# EAGLE design SerialGateway (EAGLE 7.3.0)
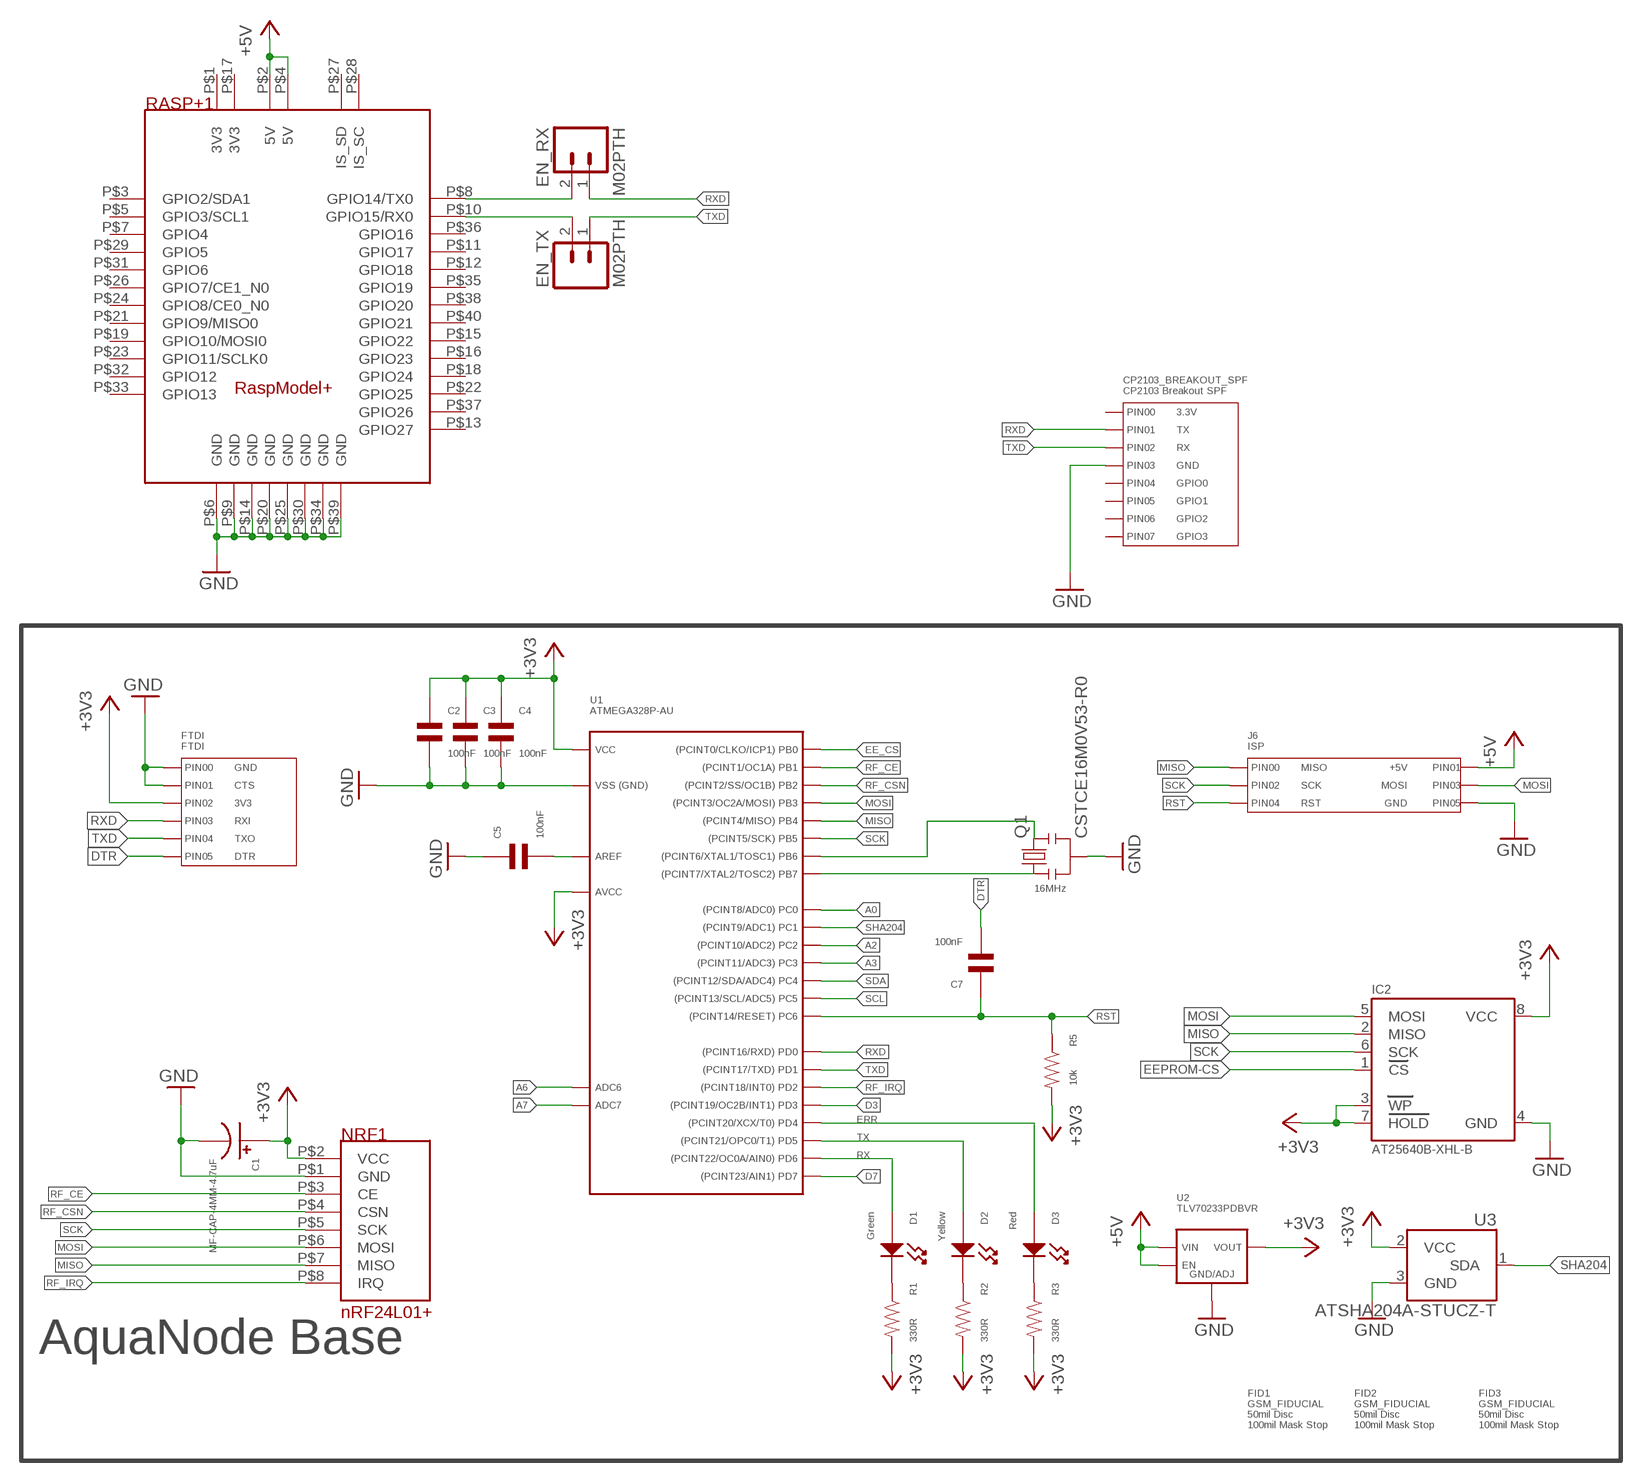
[diagram p0: schematic, sheet 1]

## Parts
C1  MF-CAP-4MM-4.7uF  CAPACITOR_P_4MM  [CP4MM]
C2  100nF  CAPACITOR_NP_0603  [C0603]
C3  100nF  CAPACITOR_NP_0603  [C0603]
C4  100nF  CAPACITOR_NP_0603  [C0603]
C5  100nF  CAPACITOR_NP_0603  [C0603]
C7  100nF  CAPACITOR_NP_0603  [C0603]
CP2103_BREAKOUT_SPF  CP2103 Breakout SPF  HEADER_01X08_PTH_2.54MM  [PTH_2.54MM_01X08]
D1  Green  LED_SINGLE_0805  [LED0805]
D2  Yellow  LED_SINGLE_0805  [LED0805]
D3  Red  LED_SINGLE_0805  [LED0805]
EN_RX  M02PTH  [1X02]
EN_TX  M02PTH  [1X02]
FID1  GSM_FIDUCIAL  [GSM_FIDUCIAL]
FID2  GSM_FIDUCIAL  [GSM_FIDUCIAL]
FID3  GSM_FIDUCIAL  [GSM_FIDUCIAL]
FTDI  FTDI  HEADER_01X06_PTH_2.54MM  [PTH_2.54MM_01X06]
IC2  AT25640B-XHL-B  EEPROM_SPI_AT25040ATSSOP  [TSSOP8-4.4MM]
J6  ISP  HEADER_02X03_PTH_2.54MM  [PTH_2.54MM_02X03]
NRF1  4Fx2-254mm  NRF24L01+.EBAY  [NRF24L01+.EBAY]
Q1  CSTCE16M0V53-R0  RESONATORSMD  [RESONATOR-SMD]
R1  330R  RESISTOR_0603  [R0603]
R2  330R  RESISTOR_0603  [R0603]
R3  330R  RESISTOR_0603  [R0603]
R5  10k  RESISTOR_0603  [R0603]
RASP+1  RASPBERRY_PI_PLUSHAT  [RASPBARRY_PI_PLUS_HAT]
U1  ATMEGA328P-AU  [TQFP32]
U2  TLV70233PDBVR  [SOT-23-5]
U3  ATSHA204A-STUCZ-T  ATSHA204-TSU  [SOT23-3]

## Nets
+3V3 [power1]: C1.P$1 C2.P$1 C3.P$1 C4.P$1 FTDI.P$3(PIN2) IC2.3(WP) IC2.7(HOLD) IC2.8(VCC) NRF1.P$2(VCC) R1.P$2 R2.P$2 R3.P$2 R5.P$2 U1.P$4(VCC) U1.P$6(VCC) U1.P$18(AVCC) U2.P$5(VOUT) U3.2(VCC)
+5V [power1]: J6.P$2(PIN1) RASP+1.P$2(5V) RASP+1.P$4(5V) U2.P$1(VIN) U2.P$3(EN)
A0: U1.P$23(PC0)
A2: U1.P$25(PC2)
A3: U1.P$26(PC3)
A6: U1.P$19(ADC6)
A7: U1.P$22(ADC7)
D3: U1.P$1(PD3)
D7: U1.P$11(PD7)
DTR: C7.P$2 FTDI.P$6(PIN5)
EE_CS: U1.P$12(PB0)
EEPROM-CS: IC2.1(CS)
ERR: D3.ANODE U1.P$2(PD4)
GND [power1]: C1.P$2 C2.P$2 C3.P$2 C4.P$2 C5.P$1 CP2103_BREAKOUT_SPF.P$4(PIN3) FTDI.P$1(PIN0) FTDI.P$2(PIN1) IC2.4(GND) J6.P$6(PIN5) NRF1.P$1(GND) Q1.2 RASP+1.P$6(GND) RASP+1.P$9(GND) RASP+1.P$14(GND) RASP+1.P$20(GND) RASP+1.P$25(GND) RASP+1.P$30(GND) RASP+1.P$34(GND) RASP+1.P$39(GND) U1.P$3(GND) U1.P$5(GND) U1.P$21(GND) U2.P$2(GND/ADJ) U3.3(GND)
MISO: IC2.2(MISO) J6.P$1(PIN0) NRF1.P$7(MISO) U1.P$16(PB4)
MOSI: IC2.5(MOSI) J6.P$4(PIN3) NRF1.P$6(MOSI) U1.P$15(PB3)
N$1: EN_RX.2 RASP+1.P$8(GPIO14/TX0)
N$2: EN_TX.2 RASP+1.P$10(GPIO15/RX0)
N$3: D1.CATHODE R1.P$1
N$4: C5.P$2 U1.P$20(AREF)
N$5: D2.CATHODE R2.P$1
N$6: D3.CATHODE R3.P$1
N$22: Q1.3 U1.P$7(PB6)
N$23: Q1.1 U1.P$8(PB7)
RF_CE: NRF1.P$3(CE) U1.P$13(PB1)
RF_CSN: NRF1.P$4(CSN) U1.P$14(PB2)
RF_IRQ: NRF1.P$8(IRQ) U1.P$32(PD2)
RST: C7.P$1 J6.P$5(PIN4) R5.P$1 U1.P$29(PC6)
RX: D1.ANODE U1.P$10(PD6)
RXD: CP2103_BREAKOUT_SPF.P$2(PIN1) EN_RX.1 FTDI.P$4(PIN3) U1.P$30(PD0)
SCK: IC2.6(SCK) J6.P$3(PIN2) NRF1.P$5(SCK) U1.P$17(PB5)
SCL: U1.P$28(PC5)
SDA: U1.P$27(PC4)
SHA204: U1.P$24(PC1) U3.1(SDA)
TX: D2.ANODE U1.P$9(PD5)
TXD: CP2103_BREAKOUT_SPF.P$3(PIN2) EN_TX.1 FTDI.P$5(PIN4) U1.P$31(PD1)
Unconnected: CP2103_BREAKOUT_SPF.P$1(PIN0) CP2103_BREAKOUT_SPF.P$5(PIN4) CP2103_BREAKOUT_SPF.P$6(PIN5) CP2103_BREAKOUT_SPF.P$7(PIN6) CP2103_BREAKOUT_SPF.P$8(PIN7) RASP+1.P$3(GPIO2/SDA1) RASP+1.P$5(GPIO3/SCL1) RASP+1.P$7(GPIO4) RASP+1.P$11(GPIO17) RASP+1.P$12(GPIO18) RASP+1.P$13(GPIO27) RASP+1.P$15(GPIO22) RASP+1.P$16(GPIO23) RASP+1.P$18(GPIO24) RASP+1.P$19(GPIO10/MOSI0) RASP+1.P$21(GPIO9/MISO0) RASP+1.P$22(GPIO25) RASP+1.P$23(GPIO11/SCLK0) RASP+1.P$24(GPIO8/CE0_N0) RASP+1.P$26(GPIO7/CE1_N0) RASP+1.P$27(IS_SD) RASP+1.P$28(IS_SC) RASP+1.P$29(GPIO5) RASP+1.P$31(GPIO6) RASP+1.P$32(GPIO12) RASP+1.P$33(GPIO13) RASP+1.P$35(GPIO19) RASP+1.P$36(GPIO16) RASP+1.P$37(GPIO26) RASP+1.P$38(GPIO20) RASP+1.P$40(GPIO21)

## Notes on the sheet
- 16MHz
- AquaNode Base

## Power pins joined to a net without a drawn wire
3V3: RASP+1.P$1(3V3) RASP+1.P$17(3V3)

## Library data of the parts
C1 = MF_Passives:CAPACITOR_P: Library: MF_Passives Description: Device for Polarized Capacitors. Manufacture part number (MFG#), Voltage Rating, and Tolerance can be added via Attributes.; MFG#: N/A; TOLERANCE: N/A; VOLTAGE: N/A
C2-C5 C7 = MF_Passives:CAPACITOR_NP: Library: MF_Passives Description: Device for Non-Polarized Capacitors. Manufacture part number (MFG#), Voltage, Temperature Coefficient, and Tolerance can be added via Attributes.; MFG#: N/A; TEMP_COF: N/A; TOLERANCE: N/A; VOLTAGE: N/A
CP2103_BREAKOUT_SPF = MF_Connectors:HEADER_01X08: Library: MF_Connectors Description: Header Connector with 8 Positions and 01 Rows. Use the LABEL Attribute to label the pin on the schematic and PCB. You can remove the attributes on the PCB by using the SMASH function on the part and then deleting the text.; LABEL00: 3.3V; LABEL01: TX; LABEL02: RX; LABEL03: GND; LABEL04: GPIO0; LABEL05: GPIO1; LABEL06: GPIO2; LABEL07: GPIO3
D1-D3 = MF_LEDs:LED_SINGLE: Library: MF_LEDs Description: Device for Single LED Packages. Manufacture part number (MFG#) can be added via Attributes.
EN_RX EN_TX = SparkFun-Connectors:M02: Standard 2-pin 0.1" header. Use with - straight break away headers ( PRT-00116) - right angle break away headers (PRT-00553) - swiss pins (PRT-00743) - machine pins (PRT-00117) - female headers (PRT-00115) Molex polarized connector foot print use with: PRT-08233 with associated crimp pins and housings. 2.54_SCREWTERM for use with PRT-10571. 3.5mm Screw Terminal footprints for PRT-08084 5mm Screw Terminal footprints for use with PRT-08433
FID1-FID3 = MF_Aesthetics:GSM_FIDUCIAL: Library: MF_Aesthetics Description: Fiducial marking for PCB alignment inside PNP and other machines.
FTDI = MF_Connectors:HEADER_01X06: Library: MF_Connectors Description: Header Connector with 6 Positions and 01 Rows. Use the LABEL Attribute to label the pin on the schematic and PCB. You can remove the attributes on the PCB by using the SMASH function on the part and then deleting the text.; LABEL00: GND; LABEL01: CTS; LABEL02: 3V3; LABEL03: RXI; LABEL04: TXO; LABEL05: DTR
IC2 = microbuilder:EEPROM_SPI_AT25040A: AT25010a/40a EEPROM SOIC8 AT25010a, 1K (128 x 8 bit) - Digikey: AT25010AN-10SU2.7-ND AT25040a, 4K (256 x 8 bit) - Digikey: AT25040AN-10SU1.8-ND TSSOP8 AT25010a, 1K (128 x 8 bit) - Digikey: AT25010A-10TU-1.8-ND AT25040a, 4K (256 x 8 bit) - Digikey: AT25040A-10TU-1.8-ND
J6 = MF_Connectors:HEADER_02X03: Library: MF_Connectors Description: Header Connector with 6 Positions and 02 Rows. Use the LABEL Attribute to label the pin on the schematic and PCB. You can remove the attributes on the PCB by using the SMASH function on the part and then deleting the text.; LABEL00: MISO; LABEL01: +5V; LABEL02: SCK; LABEL03: MOSI; LABEL04: RST; LABEL05: GND
NRF1 = TDK:NRF24L01+.EBAY
Q1 = _allyourbase:RESONATOR: Resonator Small SMD resonator. This is the itty bitty 10/20MHz resonators with built in caps. CSTCE10M0G55 and CSTCE20M0V53. Footprint has been reviewed closely but hasn't been tested yet.
R1-R3 R5 = MF_Passives:RESISTOR: Library: MF_Passives Description: Device for Resistors. Manufacture part number (MFG#), Voltage, Tolerance, and Wattage Rating can be added via Attributes.; MFG#: N/A; TOLERANCE: N/A; VOLTAGE: N/A; WATTAGE: N/A
RASP+1 = TDK:RASPBERRY_PI_PLUS
U1 = MF_IC_Digital:ATMEGA328P: Manufacturer Part #: ATMEGA328P Manufacturer: Atmel Description: 8-bit Microcontrollers - MCU 32KB In-system Flash 20MHz 1.8V-5.5V
U2 = MF_IC_Power:TLV702: Manufacturer Part #: TLV702 Manufacturer: Texas Instruments Description: LDO Voltage Regulators
U3 = SparkFun-DigitalIC:ATSHA204: Atmel ATSHA204 The Atmel ATSHA204 is an optimized authentication chip that includes a 4.5Kb EEPROM. This array can be used for storage of keys, miscellaneous read/write, read-only, password or secret data, and consumption tracking. Access to the various sections of memory can be restricted in a variety of ways and then the configuration locked to prevent changes.

## Board
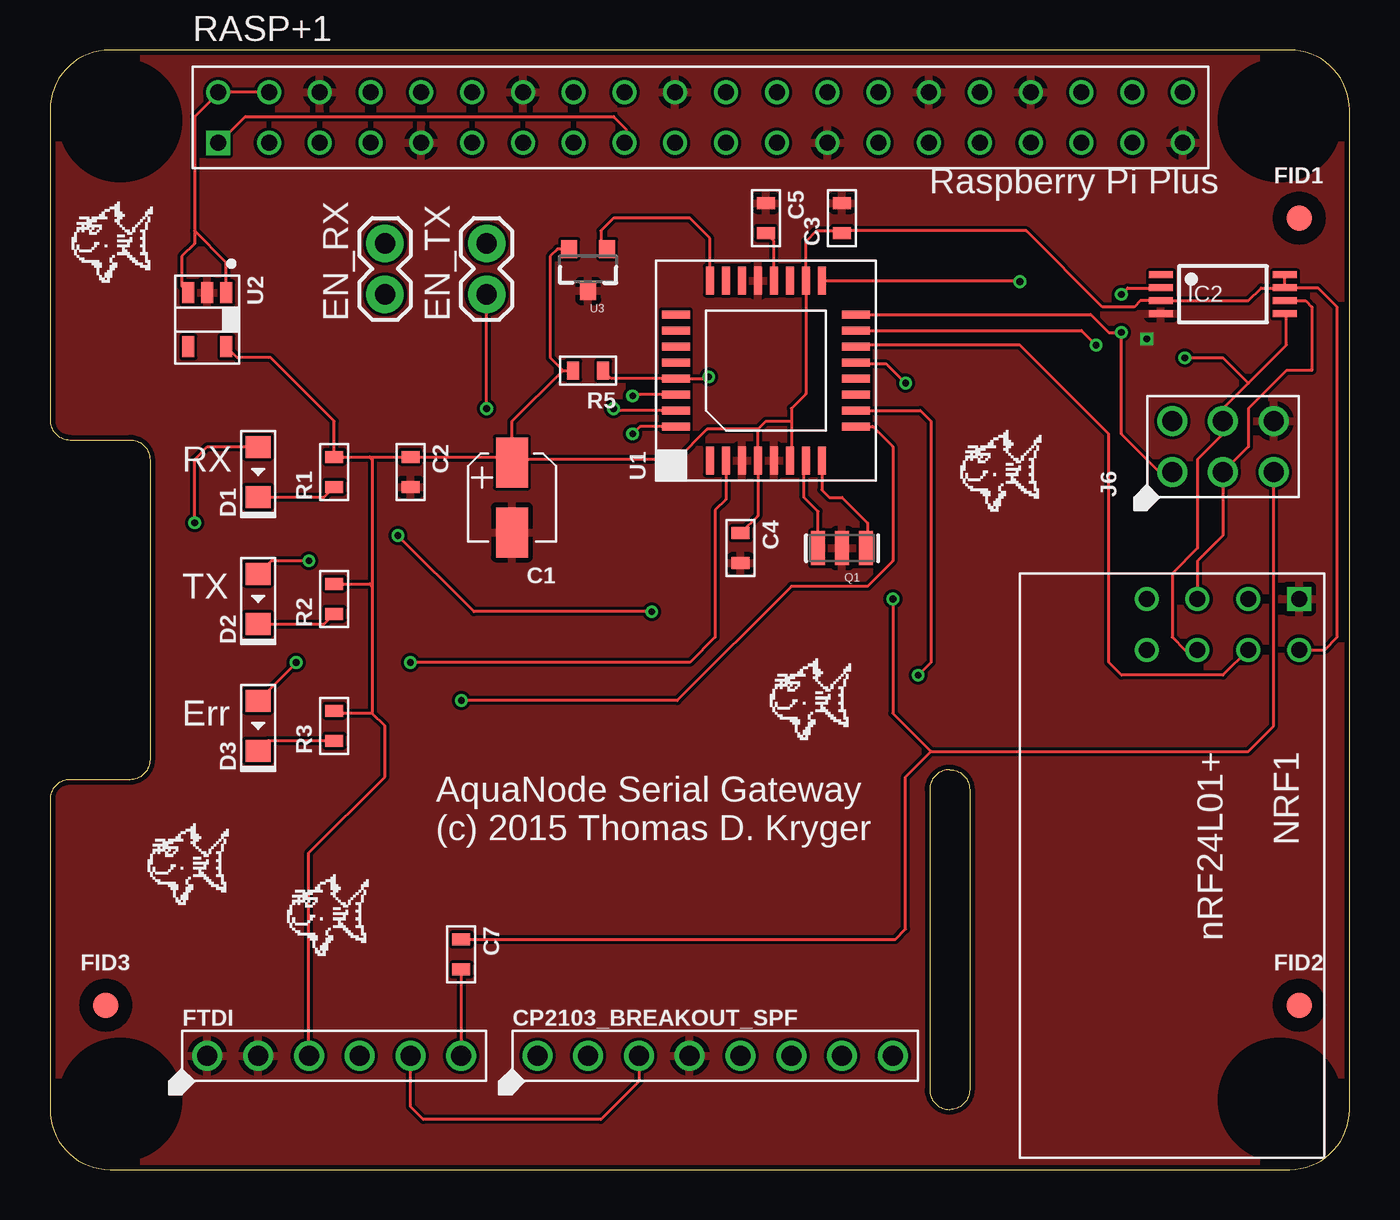
[diagram p1: board, top side]
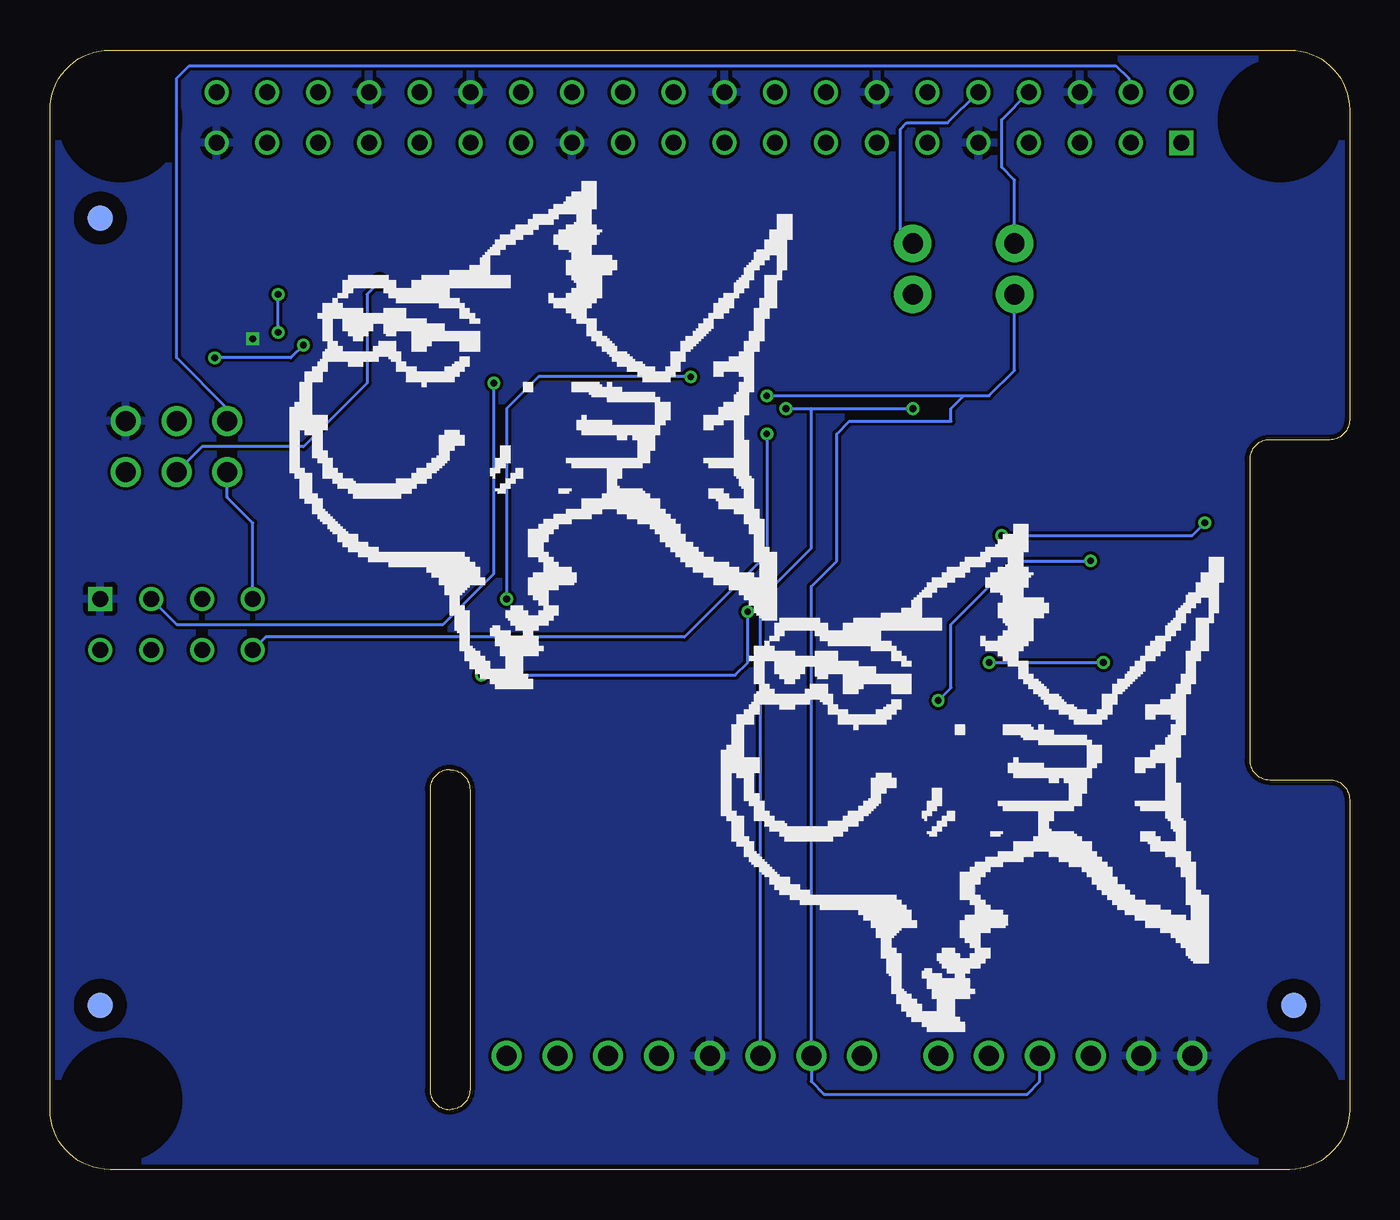
[diagram p2: board, bottom side, seen from below]

Size 65 x 56 mm. Coordinates in mm from the lower left corner, seen from the top.
Copper layers (1*16): Top 0.035mm / dielectric 0.2mm / Bottom 0.035mm
Design rules "MacroFab_MF_2_Layer": minimum track width 6mil, minimum drill 12mil, track to track 6mil, track to pad 6mil, pad to pad 6mil, via to via 6mil, smd to smd 0mil, copper to edge 10mil, drill to drill 10mil, minimum pad ring 6mil, minimum via ring 6mil, stop-mask expansion 2mil, vias tented up to drill 25mil, thermal gap 10mil

### Footprints (pad centres in the part's own frame; a part is rotated, then mirrored left to right if it is on the bottom)
CP4MM = smd 1.6 x 2.5: P$1 0,-1.75; P$2 0,1.75
C0603 = smd 0.6 x 0.9: P$1 -0.75,0; P$2 0.75,0
PTH_2.54MM_01X08 = drill 1: P$1 -8.89,0; P$2 -6.35,0; P$3 -3.81,0; P$4 -1.27,0; P$5 1.27,0; P$6 3.81,0; P$7 6.35,0; P$8 8.89,0
LED0805 = smd 1.1 x 1.25: ANODE 1.25,0; CATHODE -1.25,0
1X02 = drill 1.016 pad 1.88: 1 0,0; 2 2.54,0
GSM_FIDUCIAL = smd 1.27 x 1.27: P$1 0,0 | smd 1.27 x 1.27 bottom: P$2 0,0
PTH_2.54MM_01X06 = drill 1: P$1 -6.35,0; P$2 -3.81,0; P$3 -1.27,0; P$4 1.27,0; P$5 3.81,0; P$6 6.35,0
TSSOP8-4.4MM = smd 1.2 x 0.35: 1 -3.1,0.975; 2 -3.1,0.325; 3 -3.1,-0.325; 4 -3.1,-0.975; 5 3.1,-0.975; 6 3.1,-0.325; 7 3.1,0.325; 8 3.1,0.975
PTH_2.54MM_02X03 = drill 1: P$1 -2.54,-1.27; P$2 -2.54,1.27; P$3 0,-1.27; P$4 0,1.27; P$5 2.54,-1.27; P$6 2.54,1.27
NRF24L01+.EBAY = drill 0.8 square: P$1 -1.27,5.08 | drill 0.8: P$2 1.27,5.08; P$3 -1.27,2.54; P$4 1.27,2.54; P$5 -1.27,0; P$6 1.27,0; P$7 -1.27,-2.54; P$8 1.27,-2.54
RESONATOR-SMD = smd 0.7 x 1.7: 1 -1.2,0; 2 0,0; 3 1.2,0
R0603 = smd 0.6 x 0.9: P$1 -0.75,0; P$2 0.75,0
RASPBARRY_PI_PLUS_HAT = drill 0.8 square: P$1 -23.59,25.35 | drill 0.8: P$2 -23.59,27.89; P$3 -21.05,25.35; P$4 -21.05,27.89; P$5 -18.51,25.35; P$6 -18.51,27.89; P$7 -15.97,25.35; P$8 -15.97,27.89; P$9 -13.43,25.35; P$10 -13.43,27.89; P$11 -10.89,25.35; P$12 -10.89,27.89; P$13 -8.35,25.35; P$14 -8.35,27.89; P$15 -5.81,25.35; P$16 -5.81,27.89; P$17 -3.27,25.35; P$18 -3.27,27.89; P$19 -0.73,25.35; P$20 -0.73,27.89; P$21 1.81,25.35; P$22 1.81,27.89; P$23 4.35,25.35; P$24 4.35,27.89; P$25 6.89,25.35; P$26 6.89,27.89; P$27 9.43,25.35; P$28 9.43,27.89; P$29 11.97,25.35; P$30 11.97,27.89; P$31 14.51,25.35; P$32 14.51,27.89; P$33 17.05,25.35; P$34 17.05,27.89; P$35 19.59,25.35; P$36 19.59,27.89; P$37 22.13,25.35; P$38 22.13,27.89; P$39 24.67,25.35; P$40 24.67,27.89
TQFP32 = smd 1.4 x 0.4: P$1 -4.5,2.8; P$2 -4.5,2; P$3 -4.5,1.2; P$4 -4.5,0.4; P$5 -4.5,-0.4; P$6 -4.5,-1.2; P$7 -4.5,-2; P$8 -4.5,-2.8; P$17 4.5,-2.8; P$18 4.5,-2; P$19 4.5,-1.2; P$20 4.5,-0.4; P$21 4.5,0.4; P$22 4.5,1.2; P$23 4.5,2; P$24 4.5,2.8 | smd 0.4 x 1.4: P$9 -2.8,-4.5; P$10 -2,-4.5; P$11 -1.2,-4.5; P$12 -0.4,-4.5; P$13 0.4,-4.5; P$14 1.2,-4.5; P$15 2,-4.5; P$16 2.8,-4.5; P$25 2.8,4.5; P$26 2,4.5; P$27 1.2,4.5; P$28 0.4,4.5; P$29 -0.4,4.5; P$30 -1.2,4.5; P$31 -2,4.5; P$32 -2.8,4.5
SOT-23-5 = smd 1.05 x 0.6: P$1 -1.35,0.95; P$2 -1.35,0; P$3 -1.35,-0.95; P$4 1.35,-0.95; P$5 1.35,0.95
SOT23-3 = smd 0.8 x 0.9: 1 -0.95,-1; 2 0.95,-1; 3 0,1.1

### Placement (x,y rotation side)
C1  23.11,33.62 180 top
C2  18.03,34.89 270 top
C3  39.62,47.59 90 top
C4  34.54,31.08 270 top
C5  35.81,47.59 270 top
C7  20.57,10.76 270 top
CP2103_BREAKOUT_SPF  33.27,5.68 0 top
D1  10.41,34.89 90 top
D2  10.41,28.54 90 top
D3  10.41,22.19 90 top
EN_RX  16.76,43.78 90 top
EN_TX  21.84,43.78 90 top
FID1  62.48,47.59 0 top
FID2  62.48,8.22 0 top
FID3  2.79,8.22 0 top
FTDI  14.22,5.68 0 top
IC2  58.67,43.78 0 top
J6  58.67,36.16 0 top
NRF1  57.4,27.27 270 top
Q1  39.62,31.08 180 top
R1  14.22,34.89 90 top
R2  14.22,28.54 90 top
R3  14.22,22.19 90 top
R5  26.92,39.97 180 top
RASP+1  32,26 0 top
U1  35.81,39.97 90 top
U2  7.87,42.51 270 top
U3  26.92,45.05 180 top
U$1  [THEFISH_SMALL]  6.6,15.2 0 top
U$2  [THEFISH_SMALL]  13.58,12.66 0 top
U$3  [THEFISH_SMALL]  37.71,23.46 0 top
U$4  [THEFISH_SMALL]  2.79,46.32 0 top
U$5  [THEFISH_SMALL]  47.24,34.89 0 top
U$6  [THEFISH]  31.36,6.95 0 bottom
U$7  [THEFISH]  52.95,24.09 0 bottom

### Tracks (layer width: path | path; a pad name or v marks a point on that pad's centre or on a via)
3V3
  Top 0.152: RASP+1.P$1 8.45,51.35 9.77,52.67 28.19,52.67 28.82,52.03 28.82,51.45 RASP+1.P$17
+3V3
  Top 0.152: FTDI.P$3 12.95,15.84 16.76,19.65 16.76,22.19 16.12,22.82 | 16.12,22.82 14.33,22.82 R3.P$2 | R1.P$2 C2.P$1 22.84,35.64 C1.P$1 | R1.P$2 14.22,37.43 11.04,40.6 9.37,40.6 U2.P$5 | R1.P$2 16.01,35.64 16.12,35.52 16.12,29.17 | 16.12,29.17 16.12,22.82 | R2.P$2 16.01,29.29 16.12,29.17 | 37.08,37.43 37.08,38.06 37.81,38.8 U1.P$18 37.81,46.41 38.35,46.95 39.5,46.95 C3.P$1 39.73,46.95 48.83,46.95 52.64,43.15 54.22,43.15 54.53,43.45 IC2.3 59.93,43.45 60.58,44.1 61.76,44.1 IC2.7 | 37.08,37.43 37.08,35.54 U1.P$6 | 35.41,37.03 U1.P$4 35.41,32.7 C4.P$1 | 35.41,37.03 35.81,37.43 37.08,37.43 | C1.P$1 23.11,37.43 25.65,39.97 | 25.65,39.97 R5.P$2 | U3.2 25.38,46.05 25.02,45.69 25.02,40.6 25.65,39.97 | IC2.7 IC2.8 | NRF1.P$2 63.75,26 64.38,26.63 64.38,43.15 63.43,44.1 61.78,44.1 IC2.7 | 35.41,37.03 32.87,37.03 31.36,35.52 23.27,35.52 C1.P$1
+5V
  Top 0.152: RASP+1.P$4 RASP+1.P$2 8.41,53.84 7.23,52.67 7.23,46.95 | 7.23,46.95 7.23,46.32 6.6,45.69 6.6,44.18 U2.P$3 | U2.P$1 8.82,45.37 7.23,46.95
  Bottom 0.152: J6.P$2 56.13,38.06 58.67,40.6 58.67,54.58 58.03,55.21 11.68,55.21 11.04,54.58 11.04,53.98 RASP+1.P$4
DTR
  Top 0.152: C7.P$2 FTDI.P$6
ERR  (via drill 0.33)
  Top 0.152: U1.P$2 33.81,33.52 33.27,32.98 33.27,26.63 32,25.36 v18.03,25.36 | v12.31,25.36 12.31,25.34 D3.ANODE
  Bottom 0.152: v18.03,25.36 v12.31,25.36
GND  (via drill 0.33)
  other vias: 54.86,41.56
  pour Bottom: -4.83,60.29 70.1,60.29 70.1,-3.21 -4.83,-3.21
  pour Top: -3.56,59.02 68.83,59.02 68.83,-1.94 -3.56,-1.94
MISO  (via drill 0.33)
  Top 0.152: J6.P$1 55.49,34.89 53.59,36.8 v53.59,41.88 52.95,41.88 52.06,42.77 U1.P$16 | v53.59,43.78 53.91,44.1 55.56,44.1 IC2.2
  Bottom 0.152: v53.59,41.88 v53.59,43.78 | NRF1.P$7 54.86,32.35 56.13,33.62 J6.P$1
MOSI  (via drill 0.33)
  Top 0.152: 59.94,39.34 58.67,38.06 J6.P$4 58.67,36.8 57.4,35.52 57.4,31.08 56.13,29.81 56.13,26.63 56.77,26 NRF1.P$6 | 59.94,39.34 61.84,41.24 61.84,42.73 IC2.5 | U1.P$15 51.59,41.97 v52.32,41.24 | v56.77,40.6 58.67,40.6 59.94,39.34
  Bottom 0.152: v52.32,41.24 52.95,40.6 v56.77,40.6
N$1
  Bottom 0.152: EN_RX.2 16.76,49.49 17.39,50.13 17.39,52.52 RASP+1.P$8
N$2
  Bottom 0.152: EN_TX.2 22.47,46.95 22.47,52.03 22.16,52.35 20.11,52.35 RASP+1.P$10
N$3
  Top 0.152: D1.CATHODE 13.72,33.64 R1.P$1
N$4
  Top 0.152: U1.P$20 36.21,46.44 C5.P$2
N$5
  Top 0.152: D2.CATHODE 13.72,27.29 R2.P$1
N$6
  Top 0.152: R3.P$1 10.91,21.44 D3.CATHODE
N$22
  Top 0.152: Q1.3 38.42,32.91 37.71,33.62 37.71,35.38 U1.P$7
N$23
  Top 0.152: U1.P$8 38.61,33.99 38.98,33.62 39.62,33.62 40.89,32.35 40.89,31.15 Q1.1
RF_CE  (via drill 0.33)
  Top 0.152: v42.79,39.34 41.84,40.29 40.39,40.29 U1.P$13
  Bottom 0.152: NRF1.P$3 58.67,27.27 45.33,27.27 42.79,29.81 v42.79,39.34
RF_CSN
  Top 0.152: NRF1.P$4 58.67,24.73 53.59,24.73 52.95,25.36 52.95,36.8 48.51,41.24 40.38,41.24 U1.P$14
RF_IRQ  (via drill 0.33)
  Top 0.152: U1.P$32 29.52,37.17 v29.14,36.8
  Bottom 0.152: v29.14,36.8 29.14,30.76 33.27,26.63 54.22,26.63 NRF1.P$8
RST  (via drill 0.33)
  Top 0.152: R5.P$1 28.07,39.57 U1.P$29 32.87,39.57 v32.95,39.65 | C7.P$1 42.27,11.51 42.79,12.03 42.79,19.65 44.06,20.92 | 44.06,20.92 59.94,20.92 61.21,22.19 J6.P$5 | v42.16,28.54 42.16,22.82 44.06,20.92
  Bottom 0.152: v32.95,39.65 40.57,39.65 42.16,38.06 v42.16,28.54
RX  (via drill 0.33)
  Top 0.152: U1.P$10 43.52,37.97 44.06,37.43 44.06,25.36 v43.43,24.73 | v30.09,27.91 21.2,27.91 v17.39,31.72 | v7.23,32.35 7.23,35.52 7.87,36.16 10.39,36.16 D1.ANODE
  Bottom 0.152: v43.43,24.73 30.73,24.73 30.09,25.36 v30.09,27.91 | v17.39,31.72 7.87,31.72 v7.23,32.35
RXD  (via drill 0.33)
  Top 0.152: U1.P$30 29.21,38.77 v29.14,38.7
  Bottom 0.152: FTDI.P$4 15.49,4.41 16.12,3.78 26.28,3.78 26.92,4.41 CP2103_BREAKOUT_SPF.P$2 26.92,29.17 25.65,30.45 25.65,36.8 25.02,37.43 19.93,37.43 19.93,38.06 19.3,38.7 | v29.14,38.7 19.3,38.7 | 19.3,38.7 18.03,38.7 16.76,39.97 EN_RX.1
SCK  (via drill 0.33)
  Top 0.152: IC2.6 62.8,43.45 63.11,43.15 63.11,39.97 61.84,39.97 59.94,38.06 59.94,36.16 J6.P$3 58.67,31.72 57.4,30.45 NRF1.P$5 | U1.P$17 48.45,44.47 v48.51,44.41
  Bottom 0.152: v48.51,44.41 49.14,43.78 49.14,39.34 52.32,36.16 57.4,36.16 J6.P$3
SHA204
  Top 0.152: U1.P$24 33.01,46.58 32,47.59 28.19,47.59 27.55,46.95 27.55,46.37 U3.1
TX  (via drill 0.33)
  Top 0.152: U1.P$9 41.15,37.17 42.16,36.16 42.16,30.45 40.89,29.17 37.08,29.17 31.36,23.46 v20.57,23.46 | v12.95,30.45 11.06,30.45 D2.ANODE
  Bottom 0.152: v20.57,23.46 19.93,24.09 19.93,27.27 16.76,30.45 v12.95,30.45
TXD  (via drill 0.33)
  Top 0.152: CP2103_BREAKOUT_SPF.P$3 29.46,4.41 27.55,2.51 18.66,2.51 18.03,3.14 FTDI.P$5 | U1.P$31 28.28,37.97 v28.19,38.06 | v21.84,38.06 EN_TX.1
  Bottom 0.152: v28.19,38.06 26.92,38.06 | 26.92,38.06 v21.84,38.06 | CP2103_BREAKOUT_SPF.P$3 29.46,28.54 26.92,31.08 26.92,38.06

### Text on the board
tNames: RX | TX | Err | AquaNode Serial Gateway / (c) 2015 Thomas D. Kryger